# EAGLE design SNES-USB (EAGLE 4.16)
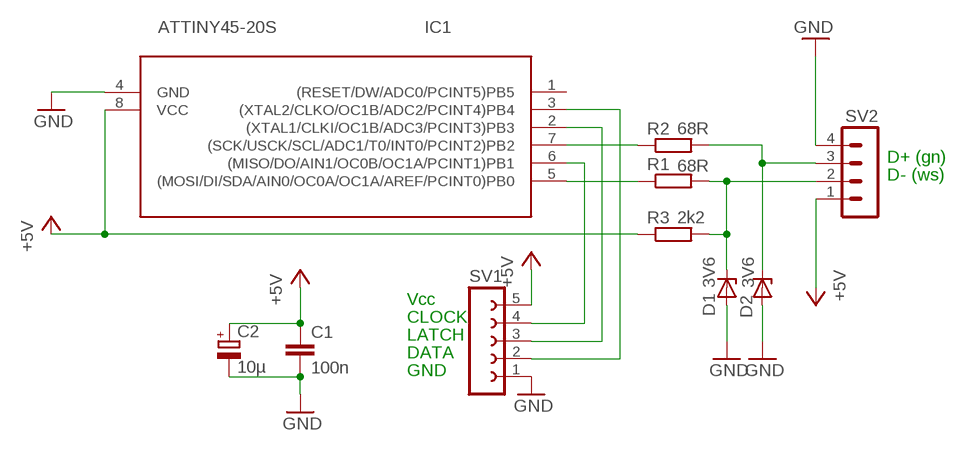
[diagram p0: schematic, sheet 1]

## Parts
C1  100n  C-EUC1206  [C1206]
C2  10µ  CPOL-EUSMCC  [SMC_C]
D1  3V6  ZENER-DIODESOD80C  [SOD80C]
D2  3V6  ZENER-DIODESOD80C  [SOD80C]
IC1  ATTINY45-20S  [SOIC8]
R1  68R  R-EU_R1206  [R1206]
R2  68R  R-EU_R1206  [R1206]
R3  2k2  R-EU_R1206  [R1206]
SV1  FE05-1  [FE05-1]
SV2  MA04-1  [MA04-1]

## Nets
+5V: C1.1 C2.+ IC1.8(VCC) R3.1 SV1.5 SV2.1
GND: C1.2 C2.- D1.A D2.A IC1.4(GND) SV1.1 SV2.4
N$1: IC1.5((MOSI/DI/SDA/AIN0/OC0A/OC1A/AREF/PCINT0)PB0) R1.1
N$2: IC1.7((SCK/USCK/SCL/ADC1/T0/INT0/PCINT2)PB2) R2.1
N$3: D1.C R1.2 R3.2 SV2.2
N$4: D2.C R2.2 SV2.3
N$5: IC1.6((MISO/DO/AIN1/OC0B/OC1A/PCINT1)PB1) SV1.4
N$6: IC1.2((XTAL1/CLKI/OC1B/ADC3/PCINT3)PB3) SV1.3
N$7: IC1.3((XTAL2/CLKO/OC1B/ADC2/PCINT4)PB4) SV1.2
Unconnected: IC1.1((RESET/DW/ADC0/PCINT5)PB5)

## Notes on the sheet
- D+ (gn)
- D- (ws)
- Vcc
- CLOCK
- LATCH
- DATA
- GND

## Library data of the parts
C1 = rcl:C-EU: CAPACITOR, European symbol
C2 = rcl:CPOL-EU: POLARIZED CAPACITOR, European symbol
D1 D2 = diode:ZENER-DIODE: Z-Diode
IC1 = avr:ATTINY45: MICROCONTROLLER 4 Kbytes FLASH 256 bytes EEPROM 256 bytes RAM 4-channel 10 bit ADC USI
R1-R3 = rcl:R-EU_: RESISTOR, European symbol
SV1 = con-lsta:FE05-1: FEMALE HEADER
SV2 = con-lstb:MA04-1: PIN HEADER

## Board
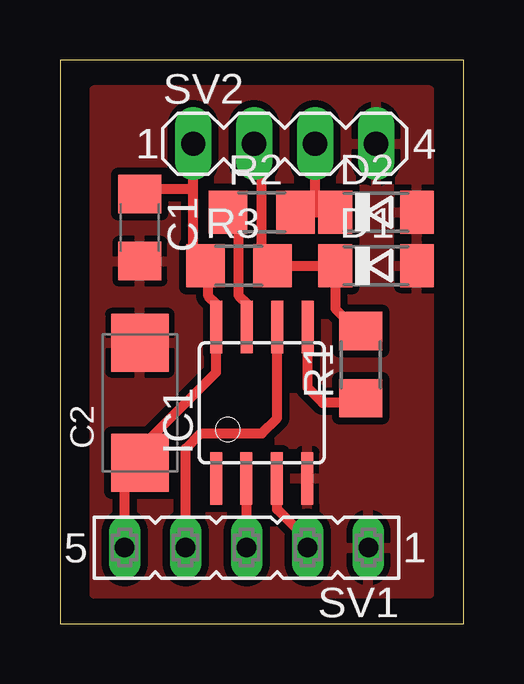
[diagram p1: board, top side]

Size 16.81 x 23.48 mm. Coordinates in mm from the lower left corner, seen from the top.
Outline: 0,0 16.81,0 16.81,23.48 0,23.48 0,0
Copper layers (1*16): Top 0.035mm / dielectric 1.5mm / Bottom 0.035mm
Design rules "default": minimum track width 10mil, minimum drill 24mil, track to track 8mil, track to pad 8mil, pad to pad 8mil, via to via 8mil, smd to smd 8mil, copper to edge 40mil, drill to drill 8mil, minimum pad ring 10mil, minimum via ring 8mil, stop-mask expansion 4mil, vias tented up to drill 0mil, thermal gap 10mil

### Footprints (pad centres in the part's own frame; a part is rotated, then mirrored left to right if it is on the bottom)
C1206 = smd 1.6 x 1.8: 1 -1.4,0; 2 1.4,0
SMC_C = smd 2.4 x 2.4: + -2.5,0; - 2.5,0
SOD80C = smd 1.4 x 1.8: A 1.7,0; C -1.7,0
SOIC8 = smd 0.5 x 2.2: 1 -1.905,-3.154; 2 -0.645,-3.154; 3 0.625,-3.154; 4 1.895,-3.154; 5 1.905,3.154; 6 0.635,3.154; 7 -0.635,3.154; 8 -1.905,3.154
R1206 = smd 1.6 x 1.8: 1 -1.4,0; 2 1.4,0
FE05-1 = drill 0.813 long: 1 -5.08,0; 2 -2.54,0; 3 0,0; 4 2.54,0; 5 5.08,0
MA04-1 = drill 1.016 long: 1 -3.81,0; 2 -1.27,0; 3 1.27,0; 4 3.81,0

### Placement (x,y rotation side)
C1  3.33,16.5 270 top
C2  3.33,9.2 90 top
D1  13.17,14.92 0 top
D2  13.17,17.14 0 top
IC1  8.41,9.2 0 top
R1  12.54,10.79 90 top
R2  8.41,17.14 0 top
R3  7.45,14.92 0 top
SV1  7.77,3.17 180 top
SV2  9.36,20 0 top

### Tracks (layer width: path | path; a pad name or v marks a point on that pad's centre or on a via)
+5V
  Top 0.406: 2.69,6.66 6.5,10.47 IC1.8 6.5,13.33 6.18,13.65 6.18,14.6 R3.1 5.55,15.42 5.55,18.09 | SV1.5 2.69,6.66 | C1.1 3.33,18.09 5.55,18.09 | 5.55,18.09 SV2.1 | C2.+ 2.73,6.7 2.69,6.66
GND
  pour Top (isolate 0.305): 1.42,22.22 1.42,1.27 15.39,1.27 15.39,22.22
N$1
  Top 0.406: 10.31,12.38 IC1.5 10.31,9.84 10.95,9.2 12.85,9.2 12.67,9.39 R1.1
N$2
  Top 0.406: IC1.7 7.77,13.33 7.45,13.65 7.45,16.82 7.14,16.82 7.14,17.14 R2.1
N$3
  Top 0.406: SV2.2 8.41,19.68 8.41,14.92 8.72,14.6 8.72,14.92 8.86,14.47 R3.2 D1.C 11.47,13.12 12.4,12.19 R1.2
N$4
  Top 0.406: 10.63,17.14 D2.C | R2.2 10.63,17.14 | 10.63,17.14 SV2.3
N$5
  Top 0.406: 9.04,12.38 IC1.6 9.04,8.57 8.41,7.93 5.87,7.93 5.23,7.3 SV1.4
N$6
  Top 0.406: IC1.2 7.77,6.04 SV1.3
N$7
  Top 0.406: IC1.3 9.04,4.76 10.31,3.49 SV1.2